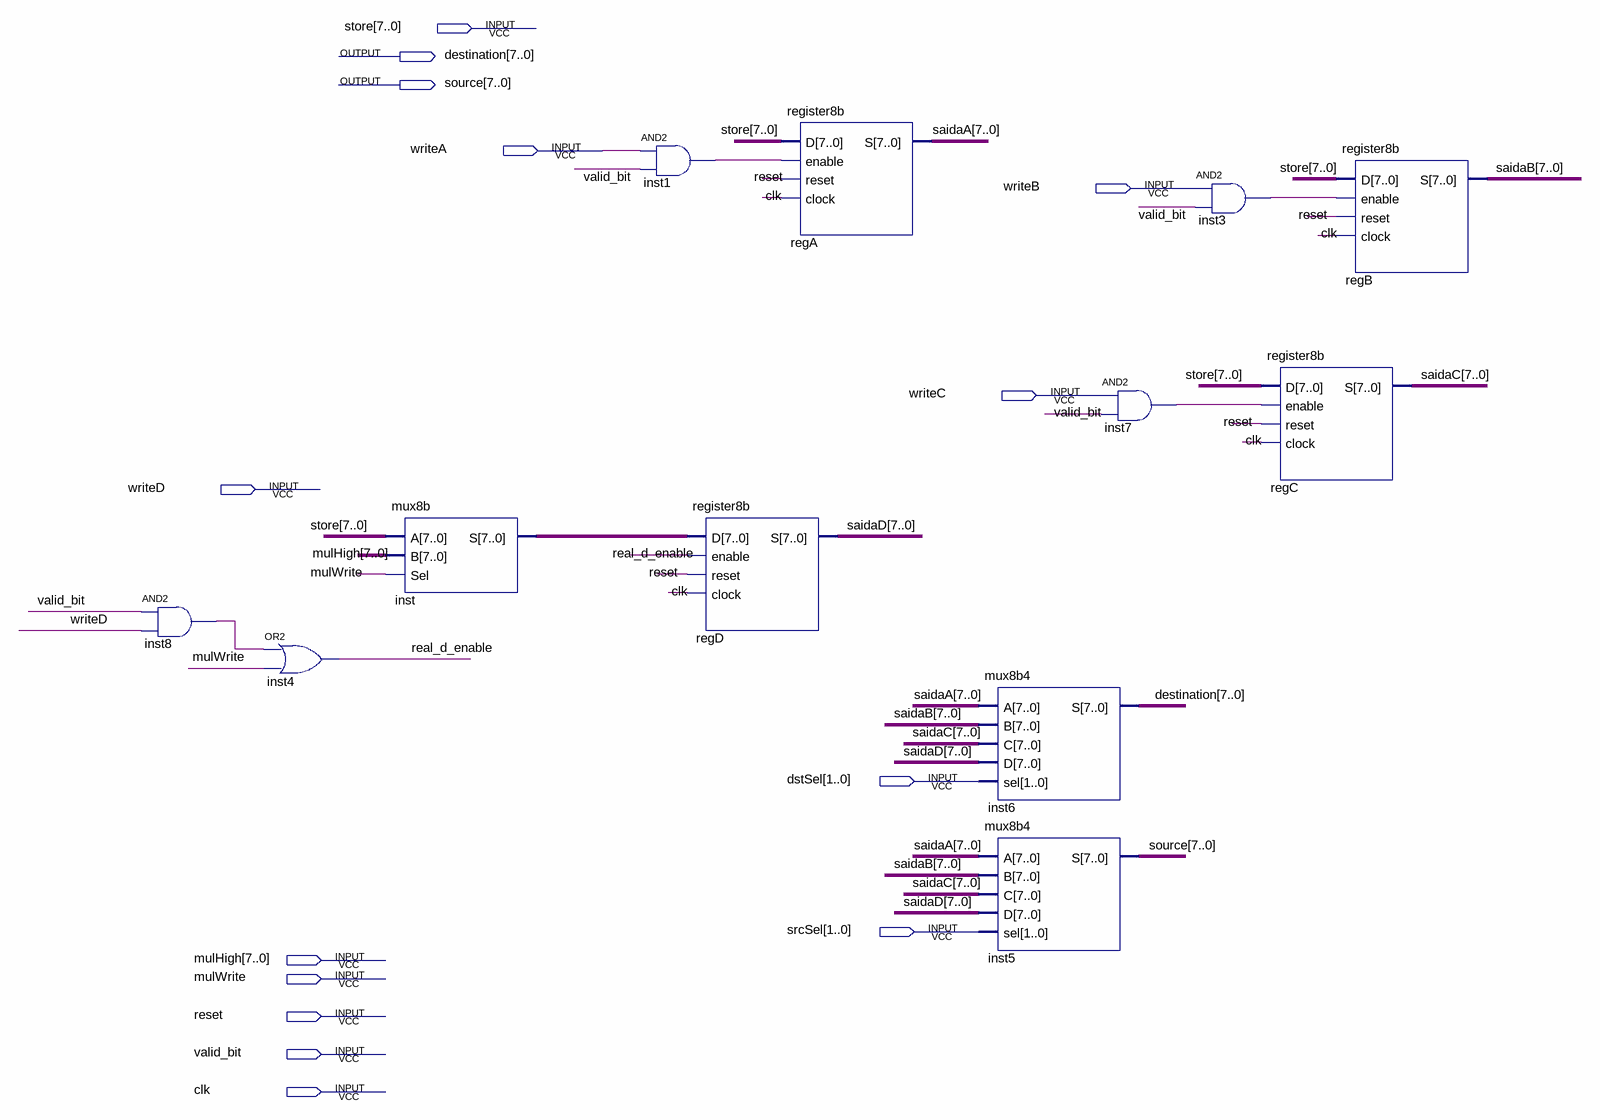
[diagram p0: schematic sheet]
// Quartus schematic gpr_bank.bdf as structural Verilog: 12 symbols, 14 pins
module gpr_bank (
  input  [7:0] store,
  input  writeA,
  input  writeB,
  input  writeC,
  input  writeD,
  input  [1:0] dstSel,
  input  [1:0] srcSel,
  input  [7:0] mulHigh,
  input  mulWrite,
  input  reset,
  input  valid_bit,
  input  clk,
  output [7:0] destination,
  output [7:0] source
);

  wire inst1_out, inst3_out, inst7_out, inst8_out, real_d_enable;
  wire [7:0] inst_s, saidaA, saidaB, saidaC, saidaD;

  and inst8 (inst8_out, valid_bit, writeD);
  or inst4 (real_d_enable, inst8_out, mulWrite);
  mux8b inst (.A(store), .B(mulHigh), .Sel(mulWrite), .S(inst_s));
  and inst1 (inst1_out, writeA, valid_bit);
  register8b regD (.D(inst_s), .enable(real_d_enable), .reset(reset), .clock(clk), .S(saidaD));
  register8b regA (.D(store), .enable(inst1_out), .reset(reset), .clock(clk), .S(saidaA));
  mux8b4 inst6 (.A(saidaA), .B(saidaB), .C(saidaC), .D(saidaD), .sel(dstSel), .S(destination));
  mux8b4 inst5 (.A(saidaA), .B(saidaB), .C(saidaC), .D(saidaD), .sel(srcSel), .S(source));
  and inst7 (inst7_out, writeC, valid_bit);
  and inst3 (inst3_out, writeB, valid_bit);
  register8b regC (.D(store), .enable(inst7_out), .reset(reset), .clock(clk), .S(saidaC));
  register8b regB (.D(store), .enable(inst3_out), .reset(reset), .clock(clk), .S(saidaB));
endmodule
